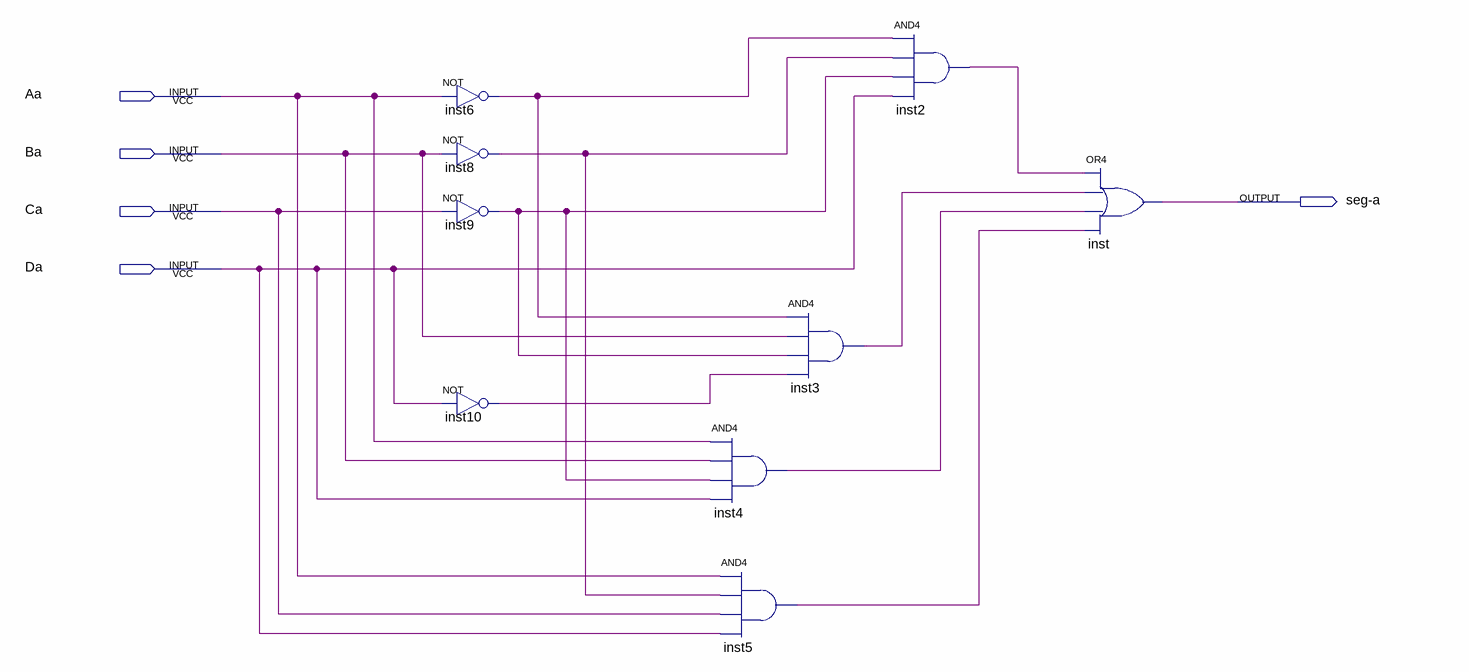
[diagram p0: schematic sheet]
// Quartus schematic segmento_a.bdf as structural Verilog: 9 symbols, 5 pins
module segmento_a (
  input  Aa,
  input  Ba,
  input  Ca,
  input  Da,
  output \seg-a 
);

  wire inst2_out, inst3_out, inst4_out, inst5_out, inst6_out, inst8_out, inst9_out, inst10_out;

  not inst6 (inst6_out, Aa);
  not inst8 (inst8_out, Ba);
  not inst9 (inst9_out, Ca);
  not inst10 (inst10_out, Da);
  and inst4 (inst4_out, Aa, Ba, inst9_out, Da);
  and inst5 (inst5_out, Aa, inst8_out, Ca, Da);
  and inst3 (inst3_out, inst6_out, Ba, inst9_out, inst10_out);
  and inst2 (inst2_out, inst6_out, inst8_out, inst9_out, Da);
  or inst (\seg-a , inst2_out, inst3_out, inst4_out, inst5_out);
endmodule
